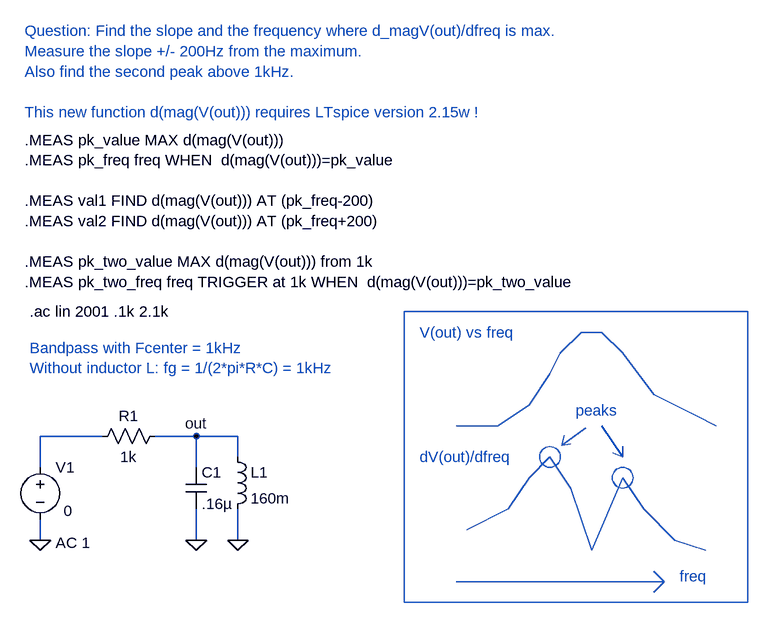
[diagram p0: schematic freq_det_peak_ac1.asc]
freq_det_peak_ac1.asc, the LTspice schematic file:
Version 4
SHEET 1 1180 680
WIRE -144 272 -144 224
WIRE -144 384 -144 352
WIRE -48 224 -144 224
WIRE 96 224 32 224
WIRE 96 272 96 224
WIRE 96 384 96 336
WIRE 160 224 96 224
WIRE 160 256 160 224
WIRE 160 384 160 336
WIRE 752 256 720 208
WIRE 752 256 752 240
FLAG 96 384 0
FLAG -144 384 0
FLAG 96 224 out
FLAG 160 384 0
SYMBOL res -64 240 R270
WINDOW 0 32 56 VTop 0
WINDOW 3 0 56 VBottom 0
SYMATTR InstName R1
SYMATTR Value 1k
SYMBOL cap 80 272 R0
SYMATTR InstName C1
SYMATTR Value .16µ
SYMBOL voltage -144 256 R0
WINDOW 123 24 132 Left 0
WINDOW 39 0 0 Left 0
WINDOW 3 36 83 Left 0
SYMATTR Value2 AC 1
SYMATTR Value 0
SYMATTR InstName V1
SYMBOL ind 144 240 R0
SYMATTR InstName L1
SYMATTR Value 160m
TEXT -160 32 Left 0 !.ac lin 2001 .1k 2.1k
TEXT -160 88 Left 0 ;Bandpass with Fcenter = 1kHz\nWithout inductor L: fg = 1/(2*pi*R*C) = 1kHz
TEXT -168 -400 Left 0 ;Question: Find the slope and the frequency where d_magV(out)/dfreq is max.\nMeasure the slope +/- 200Hz from the maximum.\nAlso find the second peak above 1kHz.\n \nThis new function d(mag(V(out))) requires LTspice version 2.15w !
TEXT -168 -232 Left 0 !.MEAS pk_value MAX d(mag(V(out)))\n.MEAS pk_freq freq WHEN  d(mag(V(out)))=pk_value\n \n.MEAS val1 FIND d(mag(V(out))) AT (pk_freq-200)\n.MEAS val2 FIND d(mag(V(out))) AT (pk_freq+200)\n \n.MEAS pk_two_value MAX d(mag(V(out))) from 1k\n.MEAS pk_two_freq freq TRIGGER at 1k WHEN  d(mag(V(out)))=pk_two_value
TEXT 440 64 Left 0 ;V(out) vs freq
TEXT 440 256 Left 0 ;dV(out)/dfreq
TEXT 840 440 Left 0 ;freq
TEXT 680 184 Left 0 ;peaks
LINE Normal 560 208 496 208
LINE Normal 608 176 560 208
LINE Normal 640 128 608 176
LINE Normal 656 96 640 128
LINE Normal 688 64 656 96
LINE Normal 720 64 688 64
LINE Normal 752 96 720 64
LINE Normal 800 160 752 96
LINE Normal 864 192 800 160
LINE Normal 896 208 864 192
LINE Normal 576 336 512 368
LINE Normal 608 288 576 336
LINE Normal 640 256 608 288
LINE Normal 672 304 640 256
LINE Normal 704 400 672 304
LINE Normal 752 288 704 400
LINE Normal 784 336 752 288
LINE Normal 832 384 784 336
LINE Normal 880 400 832 384
LINE Normal 816 448 496 448
LINE Normal 800 464 816 448
LINE Normal 816 448 800 464
LINE Normal 800 432 816 448
LINE Normal 737 250 752 256
LINE Normal 658 238 695 211
LINE Normal 662 223 658 238
LINE Normal 672 236 658 238
RECTANGLE Normal 944 480 416 32
CIRCLE Normal 656 240 624 272
CIRCLE Normal 768 272 736 304

The netlist it stands for:
* freq_det_peak_ac1.asc
R1 N001 out 1k
C1 out 0 .16µ
V1 N001 0 0 AC 1
L1 out 0 160m
.ac lin 2001 .1k 2.1k
* Bandpass with Fcenter = 1kHz
* Without inductor L: fg = 1/(2*pi*R*C) = 1kHz
* Question: Find the slope and the frequency where d_magV(out)/dfreq is max.
* Measure the slope +/- 200Hz from the maximum.
* Also find the second peak above 1kHz.
* This new function d(mag(V(out))) requires LTspice version 2.15w !
.MEAS pk_value MAX d(mag(V(out)))
.MEAS pk_freq freq WHEN  d(mag(V(out)))=pk_value
.MEAS val1 FIND d(mag(V(out))) AT (pk_freq-200)
.MEAS val2 FIND d(mag(V(out))) AT (pk_freq+200)
.MEAS pk_two_value MAX d(mag(V(out))) from 1k
.MEAS pk_two_freq freq TRIGGER at 1k WHEN  d(mag(V(out)))=pk_two_value
* V(out) vs freq
* dV(out)/dfreq
* freq
* peaks
.backanno
.end